# EAGLE schematic NN22_RPi_DetAdapter01_s00 (EAGLE 7.7.0)

## Sheet 1 of 6
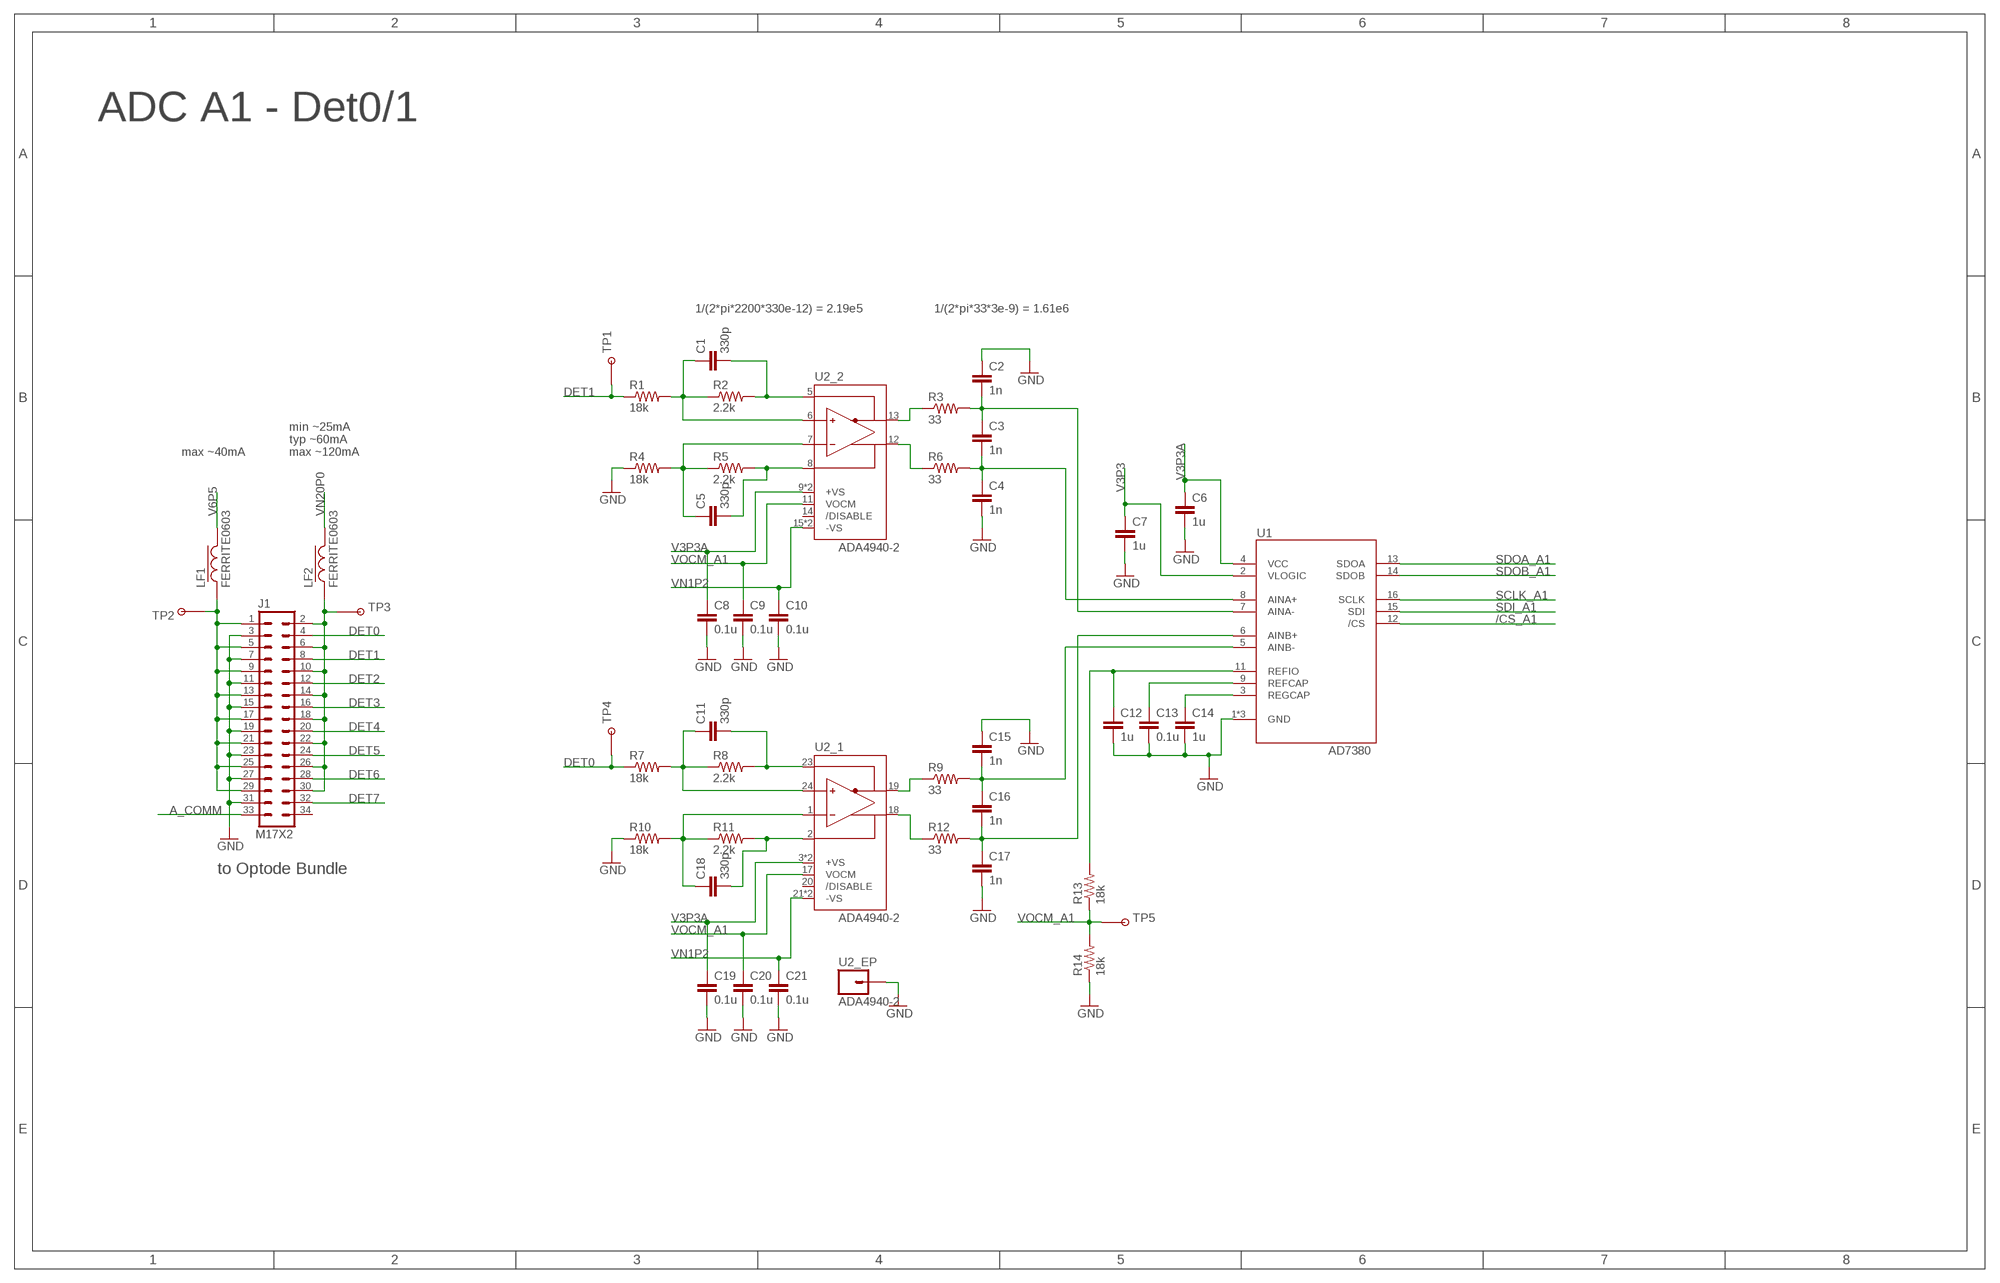
[diagram p0: schematic, sheet 1]

### Parts
C1  330p  CAP0402-CAP  [0402-CAP]
C2  1n  CAP0402-CAP  [0402-CAP]
C3  1n  CAP0402-CAP  [0402-CAP]
C4  1n  CAP0402-CAP  [0402-CAP]
C5  330p  CAP0402-CAP  [0402-CAP]
C6  1u  CAP0402-CAP  [0402-CAP]
C7  1u  CAP0402-CAP  [0402-CAP]
C8  0.1u  CAP0402-CAP  [0402-CAP]
C9  0.1u  CAP0402-CAP  [0402-CAP]
C10  0.1u  CAP0402-CAP  [0402-CAP]
C11  330p  CAP0402-CAP  [0402-CAP]
C12  1u  CAP0402-CAP  [0402-CAP]
C13  0.1u  CAP0402-CAP  [0402-CAP]
C14  1u  CAP0402-CAP  [0402-CAP]
C15  1n  CAP0402-CAP  [0402-CAP]
C16  1n  CAP0402-CAP  [0402-CAP]
C17  1n  CAP0402-CAP  [0402-CAP]
C18  330p  CAP0402-CAP  [0402-CAP]
C19  0.1u  CAP0402-CAP  [0402-CAP]
C20  0.1u  CAP0402-CAP  [0402-CAP]
C21  0.1u  CAP0402-CAP  [0402-CAP]
J1  M17X2  [M17X2_0.050_SHF]
LF1  FERRITE0603  [0603-FER]
LF2  FERRITE0603  [0603-FER]
R1  18k  RESISTOR0402-RES  [0402-RES]
R2  2.2k  RESISTOR0402-RES  [0402-RES]
R3  33  RESISTOR0402-RES  [0402-RES]
R4  18k  RESISTOR0402-RES  [0402-RES]
R5  2.2k  RESISTOR0402-RES  [0402-RES]
R6  33  RESISTOR0402-RES  [0402-RES]
R7  18k  RESISTOR0402-RES  [0402-RES]
R8  2.2k  RESISTOR0402-RES  [0402-RES]
R9  33  RESISTOR0402-RES  [0402-RES]
R10  18k  RESISTOR0402-RES  [0402-RES]
R11  2.2k  RESISTOR0402-RES  [0402-RES]
R12  33  RESISTOR0402-RES  [0402-RES]
R13  18k  RESISTOR0402-RES  [0402-RES]
R14  18k  RESISTOR0402-RES  [0402-RES]
TP1  TESTPOINT_ROUND  [TESTPAD_ROUND]
TP2  TESTPOINT_ROUND  [TESTPAD_ROUND]
TP3  TESTPOINT_ROUND  [TESTPAD_ROUND]
TP4  TESTPOINT_ROUND  [TESTPAD_ROUND]
TP5  TESTPOINT_ROUND  [TESTPAD_ROUND]
U1  AD7380  [LFCSP16]
U2  ADA4940-2  [LFCSP24]

### Nets
/CS_A1: U1.12(/CS) ; also sheet 5
A_COMM: J1.33 ; also sheet 5
DET0: J1.4 R7.1 TP4.P$1
DET1: J1.8 R1.1 TP1.P$1
DET2: J1.12 ; also sheet 3
DET3: J1.16 ; also sheet 3
DET4: J1.20 ; also sheet 2
DET5: J1.24 ; also sheet 2
DET6: J1.28 ; also sheet 4
DET7: J1.32 ; also sheet 4
GND: C2.1 C4.2 C6.2 C7.2 C8.2 C9.2 C10.2 C12.2 C13.2 C14.2 C15.1 C17.2 C19.2 C20.2 C21.2 J1.3 J1.7 J1.11 J1.15 J1.19 J1.23 J1.27 J1.31 R4.1 R10.1 R14.1 U1.1(GND) U1.10(GND) U1.EP(GND) U2.EP ; also sheet 2,3,4,5,6
N$1: R3.1 U2.13(_2:-OUT)
N$2: R6.1 U2.12(_2:+OUT)
N$3: C2.2 C3.1 R3.2 U1.7(AINA-)
N$4: C3.2 C4.1 R6.2 U1.8(AINA+)
N$5: C11.2 R8.2 U2.23(_1:-FB)
N$6: C12.1 R13.2 U1.11(REFIO)
N$7: C13.1 U1.9(REFCAP)
N$8: C14.1 U1.3(REGCAP)
N$9: C18.2 R11.2 U2.2(_1:+FB)
N$11: R9.1 U2.19(_1:-OUT)
N$12: R12.1 U2.18(_1:+OUT)
N$13: C15.2 C16.1 R9.2 U1.5(AINB-)
N$14: C16.2 C17.1 R12.2 U1.6(AINB+)
N$19: C1.1 R1.2 R2.1 U2.6(_2:+IN)
N$20: C1.2 R2.2 U2.5(_2:-FB)
N$21: C5.2 R5.2 U2.8(_2:+FB)
N$22: C5.1 R4.2 R5.1 U2.7(_2:-IN)
N$23: C11.1 R7.2 R8.1 U2.24(_1:+IN)
N$24: C18.1 R10.2 R11.1 U2.1(_1:-IN)
SCLK_A1: U1.16(SCLK) ; also sheet 5
SDI_A1: U1.15(SDI) ; also sheet 5
SDOA_A1: U1.13(SDOA) ; also sheet 5
SDOB_A1: U1.14(SDOB) ; also sheet 5
V3P3: C7.1 U1.2(VLOGIC) ; also sheet 2,3,4,5,6
V3P3A: C6.1 C8.1 C19.1 U1.4(VCC) U2.3(_1:+VS) U2.4(_1:+VS) U2.9(_2:+VS) U2.10(_2:+VS) ; also sheet 2,3,4,6
V6P5: LF1.2 ; also sheet 6
V6P5CON: J1.1 J1.5 J1.9 J1.13 J1.17 J1.21 J1.25 J1.29 LF1.1 TP2.P$1
VN1P2: C10.1 C21.1 U2.15(_2:-VS) U2.16(_2:-VS) U2.21(_1:-VS) U2.22(_1:-VS) ; also sheet 2,3,4,6
VN20P0: LF2.2 ; also sheet 6
VN20P0CON: J1.2 J1.6 J1.10 J1.14 J1.18 J1.22 J1.26 J1.30 LF2.1 TP3.P$1
VOCM_A1: C9.1 C20.1 R13.1 R14.2 TP5.P$1 U2.11(_2:VOCM) U2.17(_1:VOCM)
Unconnected: J1.34 U2.14(_2:/DISABLE) U2.20(_1:/DISABLE)

### Notes on the sheet
- ADC A1 - Det0/1
- 1/(2*pi*2200*330e-12) = 2.19e5 | 1/(2*pi*33*3e-9) = 1.61e6
- max ~40mA
- min ~25mA
  typ ~60mA
  max ~120mA
- to Optode Bundle

## Sheet 2 of 6
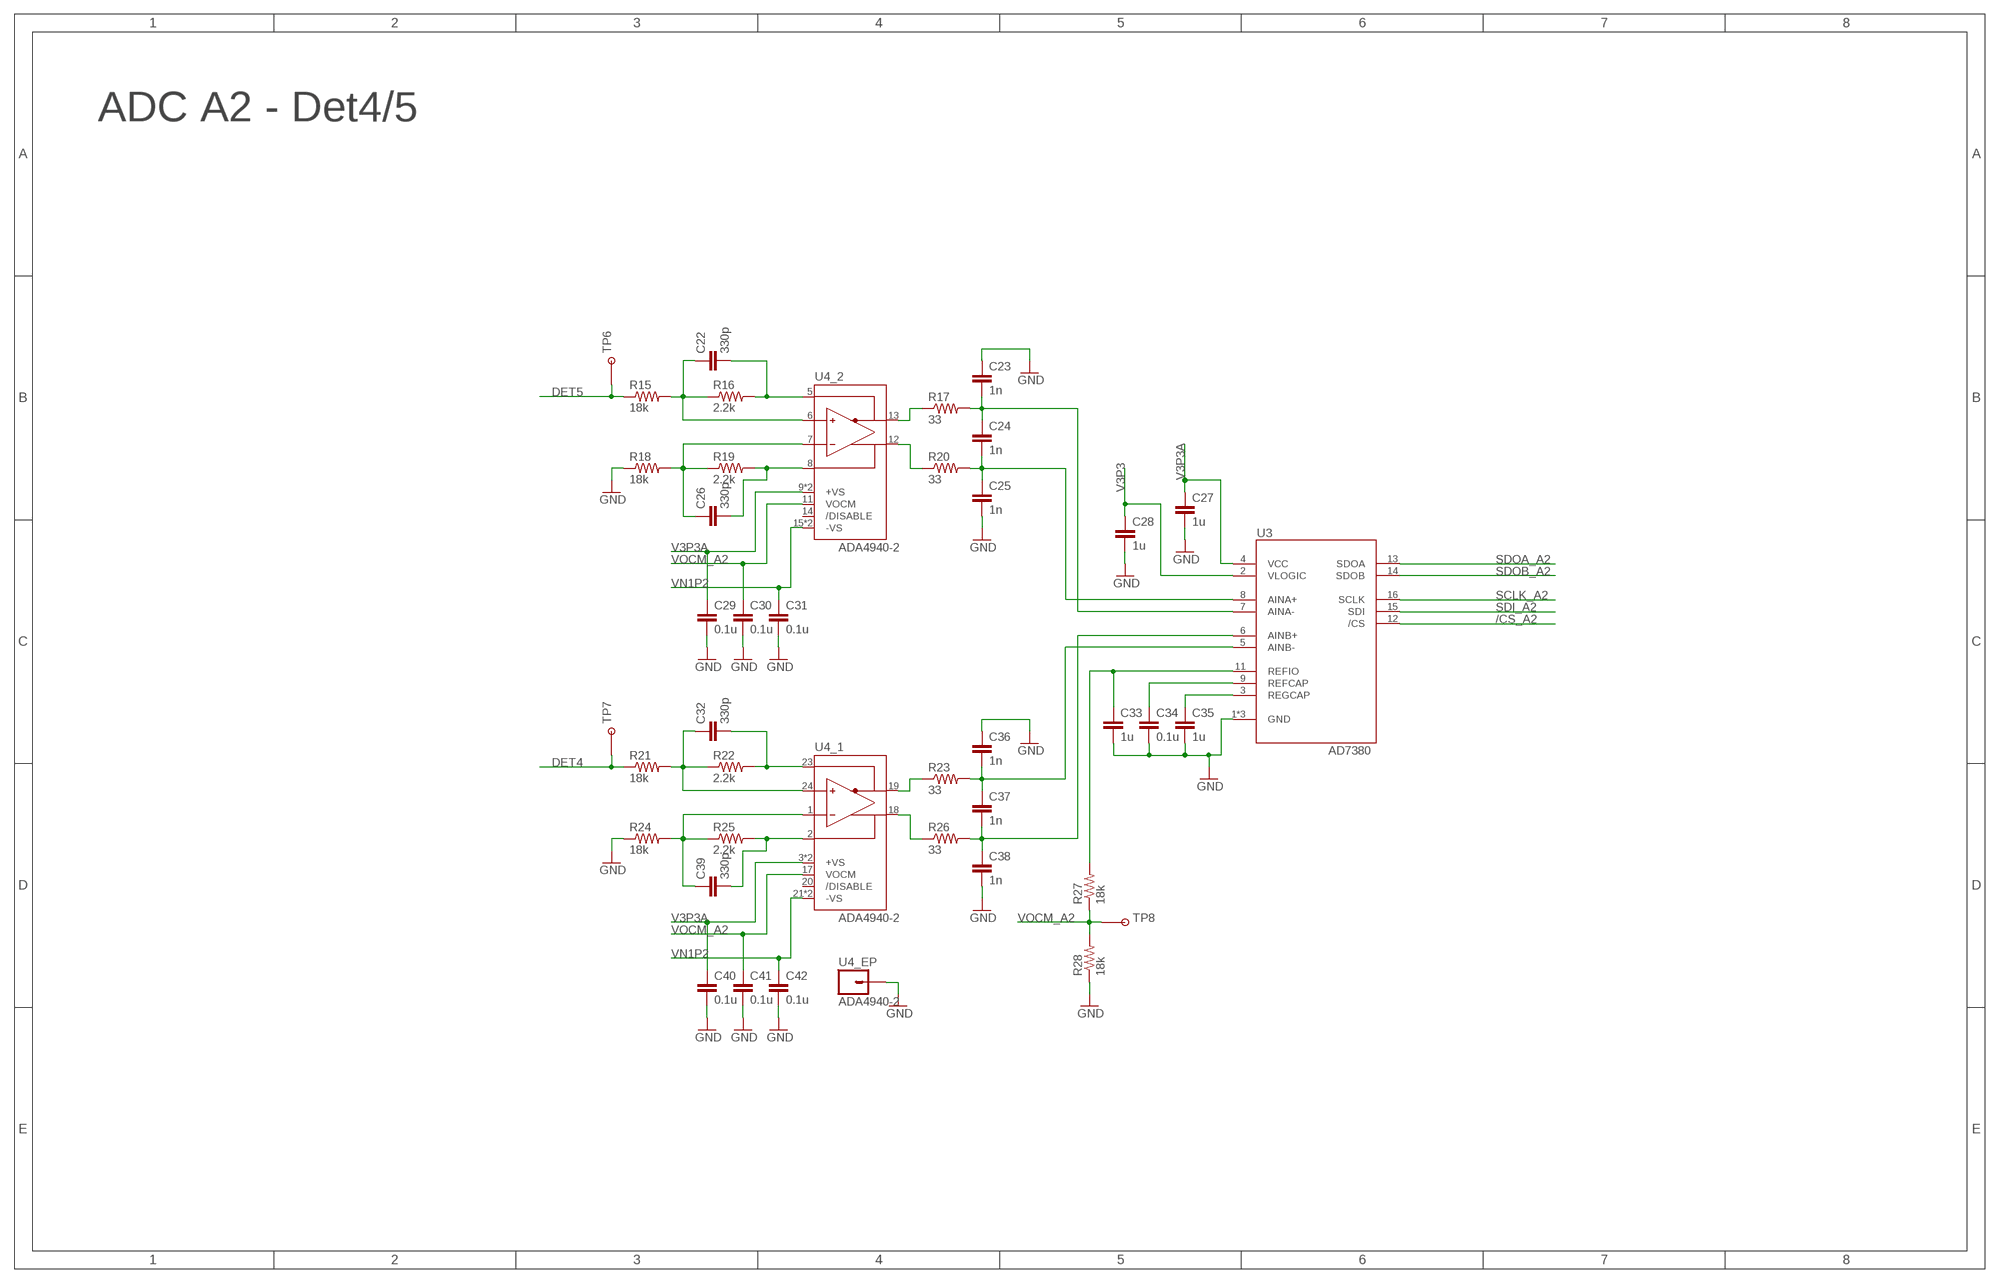
[diagram p1: schematic, sheet 2]

### Parts
C22  330p  CAP0402-CAP  [0402-CAP]
C23  1n  CAP0402-CAP  [0402-CAP]
C24  1n  CAP0402-CAP  [0402-CAP]
C25  1n  CAP0402-CAP  [0402-CAP]
C26  330p  CAP0402-CAP  [0402-CAP]
C27  1u  CAP0402-CAP  [0402-CAP]
C28  1u  CAP0402-CAP  [0402-CAP]
C29  0.1u  CAP0402-CAP  [0402-CAP]
C30  0.1u  CAP0402-CAP  [0402-CAP]
C31  0.1u  CAP0402-CAP  [0402-CAP]
C32  330p  CAP0402-CAP  [0402-CAP]
C33  1u  CAP0402-CAP  [0402-CAP]
C34  0.1u  CAP0402-CAP  [0402-CAP]
C35  1u  CAP0402-CAP  [0402-CAP]
C36  1n  CAP0402-CAP  [0402-CAP]
C37  1n  CAP0402-CAP  [0402-CAP]
C38  1n  CAP0402-CAP  [0402-CAP]
C39  330p  CAP0402-CAP  [0402-CAP]
C40  0.1u  CAP0402-CAP  [0402-CAP]
C41  0.1u  CAP0402-CAP  [0402-CAP]
C42  0.1u  CAP0402-CAP  [0402-CAP]
R15  18k  RESISTOR0402-RES  [0402-RES]
R16  2.2k  RESISTOR0402-RES  [0402-RES]
R17  33  RESISTOR0402-RES  [0402-RES]
R18  18k  RESISTOR0402-RES  [0402-RES]
R19  2.2k  RESISTOR0402-RES  [0402-RES]
R20  33  RESISTOR0402-RES  [0402-RES]
R21  18k  RESISTOR0402-RES  [0402-RES]
R22  2.2k  RESISTOR0402-RES  [0402-RES]
R23  33  RESISTOR0402-RES  [0402-RES]
R24  18k  RESISTOR0402-RES  [0402-RES]
R25  2.2k  RESISTOR0402-RES  [0402-RES]
R26  33  RESISTOR0402-RES  [0402-RES]
R27  18k  RESISTOR0402-RES  [0402-RES]
R28  18k  RESISTOR0402-RES  [0402-RES]
TP6  TESTPOINT_ROUND  [TESTPAD_ROUND]
TP7  TESTPOINT_ROUND  [TESTPAD_ROUND]
TP8  TESTPOINT_ROUND  [TESTPAD_ROUND]
U3  AD7380  [LFCSP16]
U4  ADA4940-2  [LFCSP24]

### Nets
/CS_A2: U3.12(/CS) ; also sheet 5
DET4: R21.1 TP7.P$1 ; also sheet 1
DET5: R15.1 TP6.P$1 ; also sheet 1
GND: C23.1 C25.2 C27.2 C28.2 C29.2 C30.2 C31.2 C33.2 C34.2 C35.2 C36.1 C38.2 C40.2 C41.2 C42.2 R18.1 R24.1 R28.1 U3.1(GND) U3.10(GND) U3.EP(GND) U4.EP ; also sheet 1,3,4,5,6
N$10: R17.1 U4.13(_2:-OUT)
N$15: R20.1 U4.12(_2:+OUT)
N$25: C23.2 C24.1 R17.2 U3.7(AINA-)
N$26: C24.2 C25.1 R20.2 U3.8(AINA+)
N$32: C33.1 R27.2 U3.11(REFIO)
N$33: C34.1 U3.9(REFCAP)
N$34: C35.1 U3.3(REGCAP)
N$39: R23.1 U4.19(_1:-OUT)
N$40: R26.1 U4.18(_1:+OUT)
N$41: C36.2 C37.1 R23.2 U3.5(AINB-)
N$42: C37.2 C38.1 R26.2 U3.6(AINB+)
N$45: C22.1 R15.2 R16.1 U4.6(_2:+IN)
N$46: C22.2 R16.2 U4.5(_2:-FB)
N$47: C26.2 R19.2 U4.8(_2:+FB)
N$48: C26.1 R18.2 R19.1 U4.7(_2:-IN)
N$49: C32.1 R21.2 R22.1 U4.24(_1:+IN)
N$50: C39.1 R24.2 R25.1 U4.1(_1:-IN)
N$51: C32.2 R22.2 U4.23(_1:-FB)
N$52: C39.2 R25.2 U4.2(_1:+FB)
SCLK_A2: U3.16(SCLK) ; also sheet 5
SDI_A2: U3.15(SDI) ; also sheet 5
SDOA_A2: U3.13(SDOA) ; also sheet 5
SDOB_A2: U3.14(SDOB) ; also sheet 5
V3P3: C28.1 U3.2(VLOGIC) ; also sheet 1,3,4,5,6
V3P3A: C27.1 C29.1 C40.1 U3.4(VCC) U4.3(_1:+VS) U4.4(_1:+VS) U4.9(_2:+VS) U4.10(_2:+VS) ; also sheet 1,3,4,6
VN1P2: C31.1 C42.1 U4.15(_2:-VS) U4.16(_2:-VS) U4.21(_1:-VS) U4.22(_1:-VS) ; also sheet 1,3,4,6
VOCM_A2: C30.1 C41.1 R27.1 R28.2 TP8.P$1 U4.11(_2:VOCM) U4.17(_1:VOCM)
Unconnected: U4.14(_2:/DISABLE) U4.20(_1:/DISABLE)

### Notes on the sheet
- ADC A2 - Det4/5

## Sheet 3 of 6
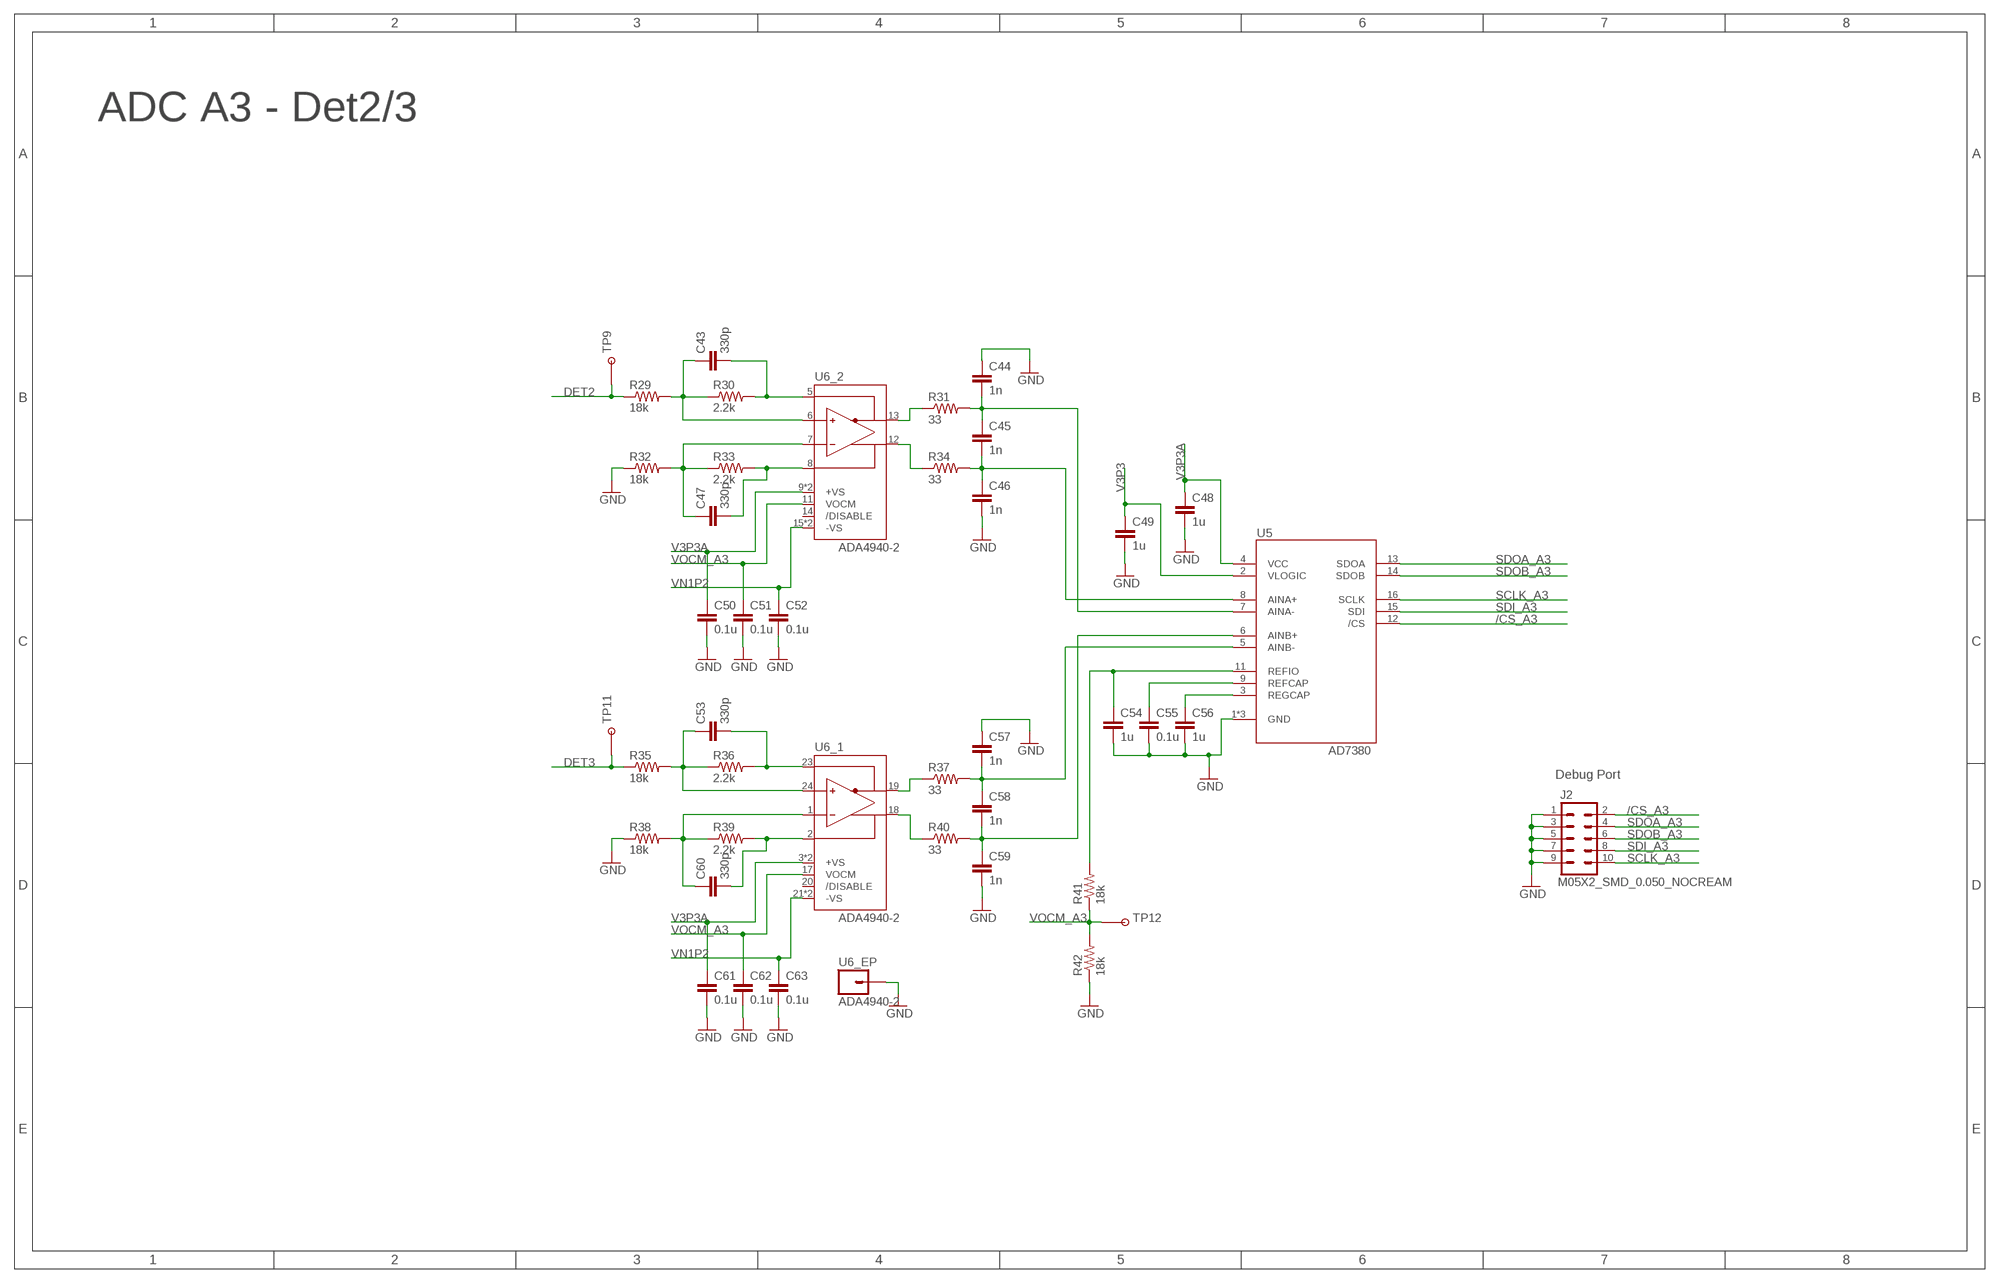
[diagram p2: schematic, sheet 3]

### Parts
C43  330p  CAP0402-CAP  [0402-CAP]
C44  1n  CAP0402-CAP  [0402-CAP]
C45  1n  CAP0402-CAP  [0402-CAP]
C46  1n  CAP0402-CAP  [0402-CAP]
C47  330p  CAP0402-CAP  [0402-CAP]
C48  1u  CAP0402-CAP  [0402-CAP]
C49  1u  CAP0402-CAP  [0402-CAP]
C50  0.1u  CAP0402-CAP  [0402-CAP]
C51  0.1u  CAP0402-CAP  [0402-CAP]
C52  0.1u  CAP0402-CAP  [0402-CAP]
C53  330p  CAP0402-CAP  [0402-CAP]
C54  1u  CAP0402-CAP  [0402-CAP]
C55  0.1u  CAP0402-CAP  [0402-CAP]
C56  1u  CAP0402-CAP  [0402-CAP]
C57  1n  CAP0402-CAP  [0402-CAP]
C58  1n  CAP0402-CAP  [0402-CAP]
C59  1n  CAP0402-CAP  [0402-CAP]
C60  330p  CAP0402-CAP  [0402-CAP]
C61  0.1u  CAP0402-CAP  [0402-CAP]
C62  0.1u  CAP0402-CAP  [0402-CAP]
C63  0.1u  CAP0402-CAP  [0402-CAP]
J2  M05X2_SMD_0.050_NOCREAM  [M05X2_0.050_SMD_NO_CREAM]
R29  18k  RESISTOR0402-RES  [0402-RES]
R30  2.2k  RESISTOR0402-RES  [0402-RES]
R31  33  RESISTOR0402-RES  [0402-RES]
R32  18k  RESISTOR0402-RES  [0402-RES]
R33  2.2k  RESISTOR0402-RES  [0402-RES]
R34  33  RESISTOR0402-RES  [0402-RES]
R35  18k  RESISTOR0402-RES  [0402-RES]
R36  2.2k  RESISTOR0402-RES  [0402-RES]
R37  33  RESISTOR0402-RES  [0402-RES]
R38  18k  RESISTOR0402-RES  [0402-RES]
R39  2.2k  RESISTOR0402-RES  [0402-RES]
R40  33  RESISTOR0402-RES  [0402-RES]
R41  18k  RESISTOR0402-RES  [0402-RES]
R42  18k  RESISTOR0402-RES  [0402-RES]
TP9  TESTPOINT_ROUND  [TESTPAD_ROUND]
TP11  TESTPOINT_ROUND  [TESTPAD_ROUND]
TP12  TESTPOINT_ROUND  [TESTPAD_ROUND]
U5  AD7380  [LFCSP16]
U6  ADA4940-2  [LFCSP24]

### Nets
/CS_A3: J2.2 U5.12(/CS) ; also sheet 5
DET2: R29.1 TP9.P$1 ; also sheet 1
DET3: R35.1 TP11.P$1 ; also sheet 1
GND: C44.1 C46.2 C48.2 C49.2 C50.2 C51.2 C52.2 C54.2 C55.2 C56.2 C57.1 C59.2 C61.2 C62.2 C63.2 J2.1 J2.3 J2.5 J2.7 J2.9 R32.1 R38.1 R42.1 U5.1(GND) U5.10(GND) U5.EP(GND) U6.EP ; also sheet 1,2,4,5,6
N$55: R31.1 U6.13(_2:-OUT)
N$56: R34.1 U6.12(_2:+OUT)
N$57: C44.2 C45.1 R31.2 U5.7(AINA-)
N$58: C45.2 C46.1 R34.2 U5.8(AINA+)
N$59: C54.1 R41.2 U5.11(REFIO)
N$60: C55.1 U5.9(REFCAP)
N$61: C56.1 U5.3(REGCAP)
N$62: R37.1 U6.19(_1:-OUT)
N$63: R40.1 U6.18(_1:+OUT)
N$64: C57.2 C58.1 R37.2 U5.5(AINB-)
N$65: C58.2 C59.1 R40.2 U5.6(AINB+)
N$68: C43.1 R29.2 R30.1 U6.6(_2:+IN)
N$69: C43.2 R30.2 U6.5(_2:-FB)
N$70: C47.2 R33.2 U6.8(_2:+FB)
N$71: C47.1 R32.2 R33.1 U6.7(_2:-IN)
N$72: C53.1 R35.2 R36.1 U6.24(_1:+IN)
N$73: C60.1 R38.2 R39.1 U6.1(_1:-IN)
N$74: C53.2 R36.2 U6.23(_1:-FB)
N$75: C60.2 R39.2 U6.2(_1:+FB)
SCLK_A3: J2.10 U5.16(SCLK) ; also sheet 5
SDI_A3: J2.8 U5.15(SDI) ; also sheet 5
SDOA_A3: J2.4 U5.13(SDOA) ; also sheet 5
SDOB_A3: J2.6 U5.14(SDOB) ; also sheet 5
V3P3: C49.1 U5.2(VLOGIC) ; also sheet 1,2,4,5,6
V3P3A: C48.1 C50.1 C61.1 U5.4(VCC) U6.3(_1:+VS) U6.4(_1:+VS) U6.9(_2:+VS) U6.10(_2:+VS) ; also sheet 1,2,4,6
VN1P2: C52.1 C63.1 U6.15(_2:-VS) U6.16(_2:-VS) U6.21(_1:-VS) U6.22(_1:-VS) ; also sheet 1,2,4,6
VOCM_A3: C51.1 C62.1 R41.1 R42.2 TP12.P$1 U6.11(_2:VOCM) U6.17(_1:VOCM)
Unconnected: U6.14(_2:/DISABLE) U6.20(_1:/DISABLE)

### Notes on the sheet
- ADC A3 - Det2/3
- Debug Port

## Sheet 4 of 6
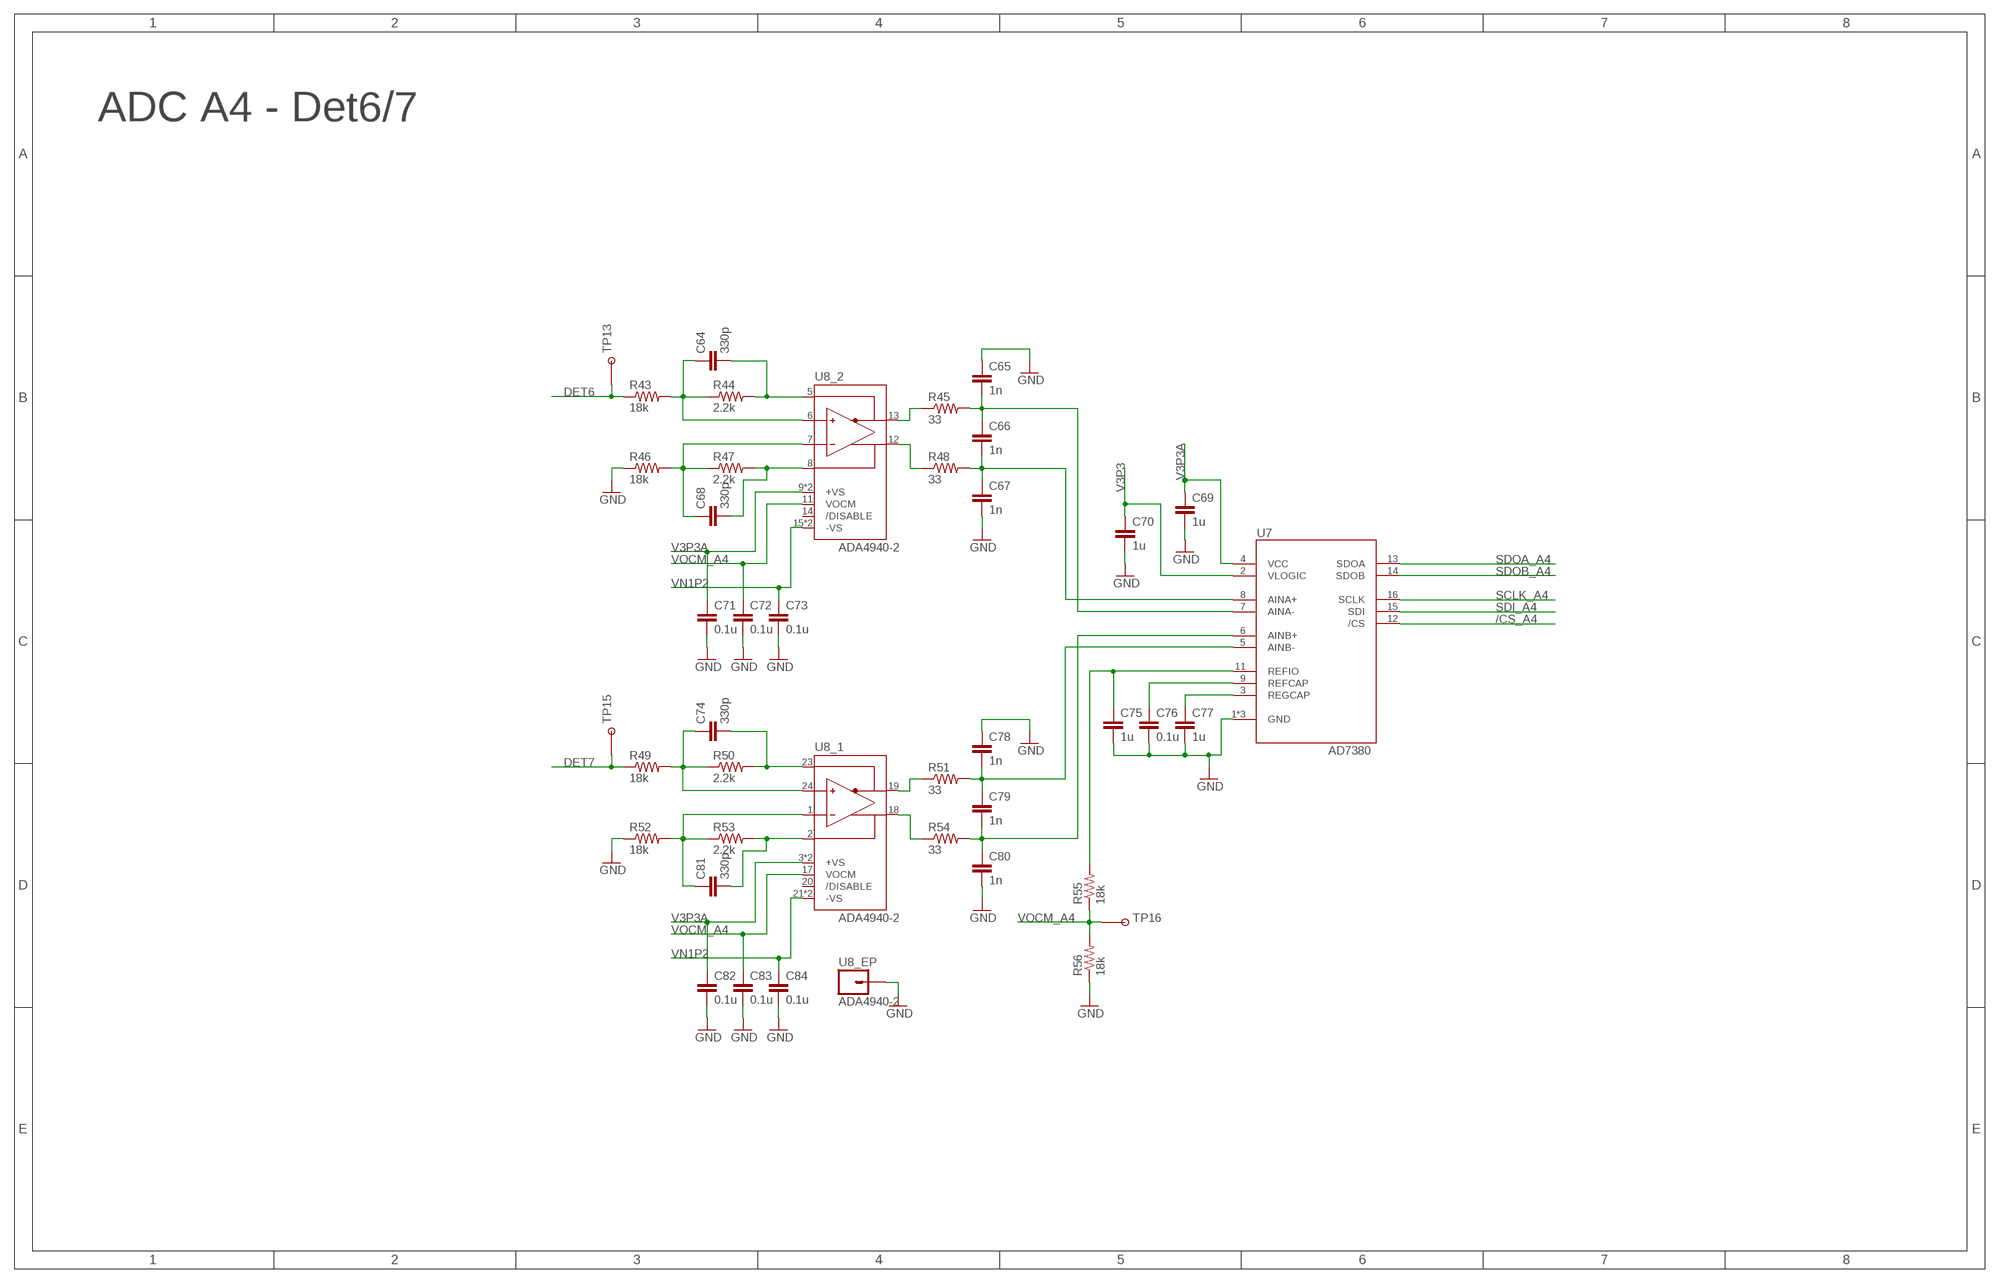
[diagram p3: schematic, sheet 4]

### Parts
C64  330p  CAP0402-CAP  [0402-CAP]
C65  1n  CAP0402-CAP  [0402-CAP]
C66  1n  CAP0402-CAP  [0402-CAP]
C67  1n  CAP0402-CAP  [0402-CAP]
C68  330p  CAP0402-CAP  [0402-CAP]
C69  1u  CAP0402-CAP  [0402-CAP]
C70  1u  CAP0402-CAP  [0402-CAP]
C71  0.1u  CAP0402-CAP  [0402-CAP]
C72  0.1u  CAP0402-CAP  [0402-CAP]
C73  0.1u  CAP0402-CAP  [0402-CAP]
C74  330p  CAP0402-CAP  [0402-CAP]
C75  1u  CAP0402-CAP  [0402-CAP]
C76  0.1u  CAP0402-CAP  [0402-CAP]
C77  1u  CAP0402-CAP  [0402-CAP]
C78  1n  CAP0402-CAP  [0402-CAP]
C79  1n  CAP0402-CAP  [0402-CAP]
C80  1n  CAP0402-CAP  [0402-CAP]
C81  330p  CAP0402-CAP  [0402-CAP]
C82  0.1u  CAP0402-CAP  [0402-CAP]
C83  0.1u  CAP0402-CAP  [0402-CAP]
C84  0.1u  CAP0402-CAP  [0402-CAP]
R43  18k  RESISTOR0402-RES  [0402-RES]
R44  2.2k  RESISTOR0402-RES  [0402-RES]
R45  33  RESISTOR0402-RES  [0402-RES]
R46  18k  RESISTOR0402-RES  [0402-RES]
R47  2.2k  RESISTOR0402-RES  [0402-RES]
R48  33  RESISTOR0402-RES  [0402-RES]
R49  18k  RESISTOR0402-RES  [0402-RES]
R50  2.2k  RESISTOR0402-RES  [0402-RES]
R51  33  RESISTOR0402-RES  [0402-RES]
R52  18k  RESISTOR0402-RES  [0402-RES]
R53  2.2k  RESISTOR0402-RES  [0402-RES]
R54  33  RESISTOR0402-RES  [0402-RES]
R55  18k  RESISTOR0402-RES  [0402-RES]
R56  18k  RESISTOR0402-RES  [0402-RES]
TP13  TESTPOINT_ROUND  [TESTPAD_ROUND]
TP15  TESTPOINT_ROUND  [TESTPAD_ROUND]
TP16  TESTPOINT_ROUND  [TESTPAD_ROUND]
U7  AD7380  [LFCSP16]
U8  ADA4940-2  [LFCSP24]

### Nets
/CS_A4: U7.12(/CS) ; also sheet 5
DET6: R43.1 TP13.P$1 ; also sheet 1
DET7: R49.1 TP15.P$1 ; also sheet 1
GND: C65.1 C67.2 C69.2 C70.2 C71.2 C72.2 C73.2 C75.2 C76.2 C77.2 C78.1 C80.2 C82.2 C83.2 C84.2 R46.1 R52.1 R56.1 U7.1(GND) U7.10(GND) U7.EP(GND) U8.EP ; also sheet 1,2,3,5,6
N$78: R45.1 U8.13(_2:-OUT)
N$79: R48.1 U8.12(_2:+OUT)
N$80: C65.2 C66.1 R45.2 U7.7(AINA-)
N$81: C66.2 C67.1 R48.2 U7.8(AINA+)
N$82: C75.1 R55.2 U7.11(REFIO)
N$83: C76.1 U7.9(REFCAP)
N$84: C77.1 U7.3(REGCAP)
N$85: R51.1 U8.19(_1:-OUT)
N$86: R54.1 U8.18(_1:+OUT)
N$87: C78.2 C79.1 R51.2 U7.5(AINB-)
N$88: C79.2 C80.1 R54.2 U7.6(AINB+)
N$91: C64.1 R43.2 R44.1 U8.6(_2:+IN)
N$92: C64.2 R44.2 U8.5(_2:-FB)
N$93: C68.2 R47.2 U8.8(_2:+FB)
N$94: C68.1 R46.2 R47.1 U8.7(_2:-IN)
N$95: C74.1 R49.2 R50.1 U8.24(_1:+IN)
N$96: C81.1 R52.2 R53.1 U8.1(_1:-IN)
N$97: C74.2 R50.2 U8.23(_1:-FB)
N$98: C81.2 R53.2 U8.2(_1:+FB)
SCLK_A4: U7.16(SCLK) ; also sheet 5
SDI_A4: U7.15(SDI) ; also sheet 5
SDOA_A4: U7.13(SDOA) ; also sheet 5
SDOB_A4: U7.14(SDOB) ; also sheet 5
V3P3: C70.1 U7.2(VLOGIC) ; also sheet 1,2,3,5,6
V3P3A: C69.1 C71.1 C82.1 U7.4(VCC) U8.3(_1:+VS) U8.4(_1:+VS) U8.9(_2:+VS) U8.10(_2:+VS) ; also sheet 1,2,3,6
VN1P2: C73.1 C84.1 U8.15(_2:-VS) U8.16(_2:-VS) U8.21(_1:-VS) U8.22(_1:-VS) ; also sheet 1,2,3,6
VOCM_A4: C72.1 C83.1 R55.1 R56.2 TP16.P$1 U8.11(_2:VOCM) U8.17(_1:VOCM)
Unconnected: U8.14(_2:/DISABLE) U8.20(_1:/DISABLE)

### Notes on the sheet
- ADC A4 - Det6/7

## Sheet 5 of 6
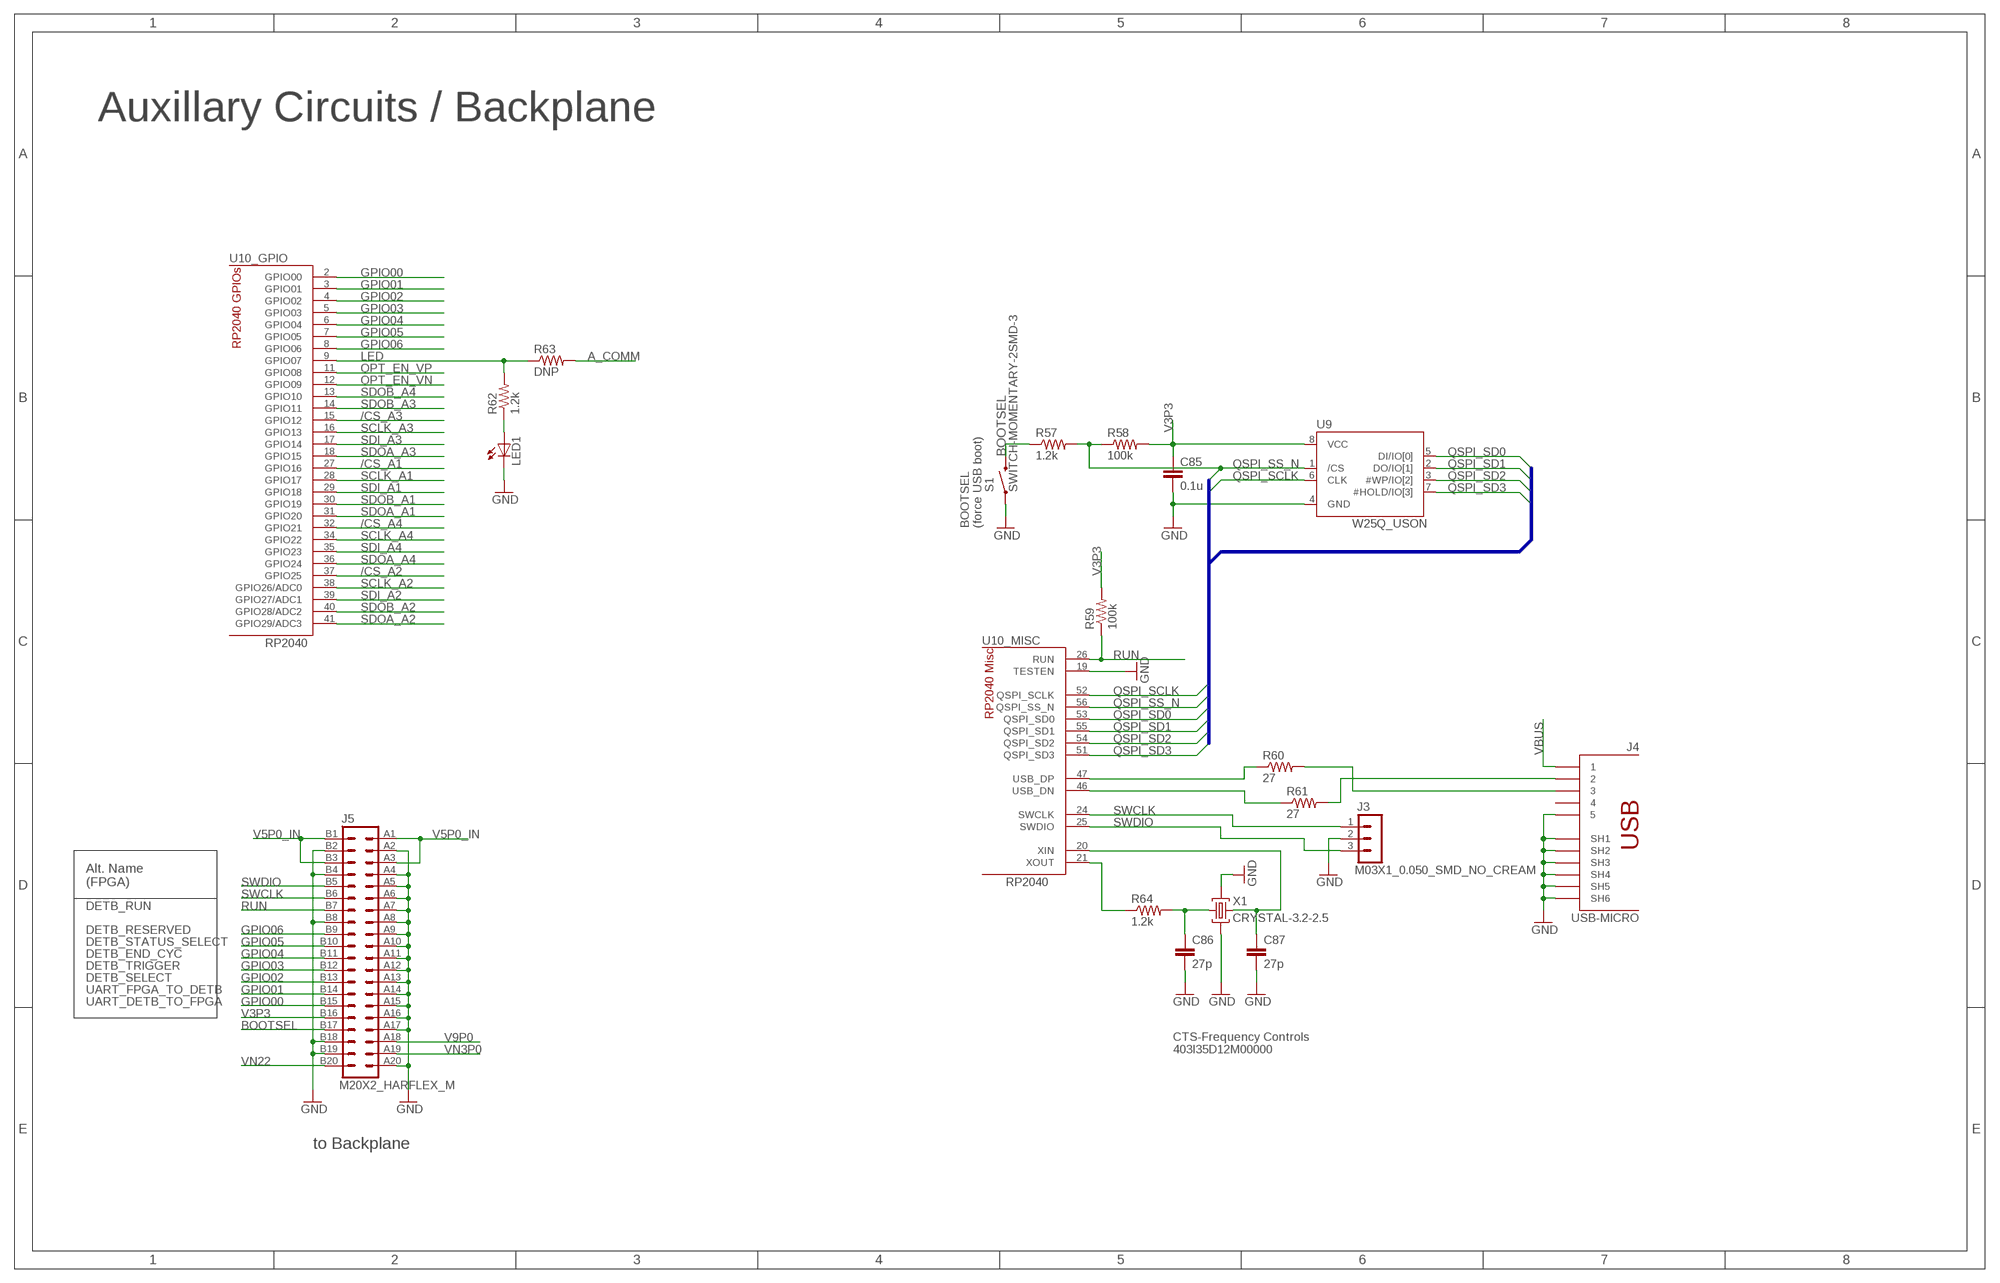
[diagram p4: schematic, sheet 5]

### Parts
C85  0.1u  CAP0402-CAP  [0402-CAP]
C86  27p  CAP0402-CAP  [0402-CAP]
C87  27p  CAP0402-CAP  [0402-CAP]
J3  M03X1_0.050_SMD_NO_CREAM  [M03X1_0.050_SMD_NO_CREAM]
J4  USB-MICRO  [USB-MICRO]
J5  M20X2_HARFLEX_M  [M20X2_HARFLEX_M]
LED1  LED0603  [LED-0603]
R57  1.2k  RESISTOR0402-RES  [0402-RES]
R58  100k  RESISTOR0402-RES  [0402-RES]
R59  100k  RESISTOR0402-RES  [0402-RES]
R60  27  RESISTOR0402-RES  [0402-RES]
R61  27  RESISTOR0402-RES  [0402-RES]
R62  1.2k  RESISTOR0402-RES  [0402-RES]
R63  DNP  RESISTOR0402-RES  [0402-RES]
R64  1.2k  RESISTOR0402-RES  [0402-RES]
S1  SWITCH-MOMENTARY-2SMD-3  [TACTILE_SWITCH_SMD-3]
U9  W25Q_USON  [USON8L-2X3MM]
U10  RP2040  [QFN-56_EP]
X1  CRYSTAL-3.2-2.5  [CRYSTAL-3.2-2.5]

### Nets
/CS_A1: U10.27(_GPIO:GPIO16) ; also sheet 1
/CS_A2: U10.37(_GPIO:GPIO25) ; also sheet 2
/CS_A3: U10.15(_GPIO:GPIO12) ; also sheet 3
/CS_A4: U10.32(_GPIO:GPIO21) ; also sheet 4
A_COMM: R63.2 ; also sheet 1
BOOTSEL: J5.B17 R57.1 S1.4
GND: C85.2 C86.2 C87.2 J3.2 J4.5 J4.SH1 J4.SH2 J4.SH3 J4.SH4 J4.SH5 J4.SH6 J5.A2 J5.A4 J5.A5 J5.A6 J5.A7 J5.A8 J5.A9 J5.A10 J5.A11 J5.A12 J5.A13 J5.A14 J5.A15 J5.A16 J5.A17 J5.A20 J5.B2 J5.B4 J5.B8 J5.B18 J5.B19 LED1.C S1.1 U9.4(GND) U10.19(_MISC:TESTEN) X1.2(GND) X1.4(GND) ; also sheet 1,2,3,4,6
GPIO00: J5.B15 U10.2(_GPIO:GPIO00)
GPIO01: J5.B14 U10.3(_GPIO:GPIO01)
GPIO02: J5.B13 U10.4(_GPIO:GPIO02)
GPIO03: J5.B12 U10.5(_GPIO:GPIO03)
GPIO04: J5.B11 U10.6(_GPIO:GPIO04)
GPIO05: J5.B10 U10.7(_GPIO:GPIO05)
GPIO06: J5.B9 U10.8(_GPIO:GPIO06)
LED: R62.2 R63.1 U10.9(_GPIO:GPIO07)
N$16: C87.1 U10.20(_MISC:XIN) X1.3(C2)
N$17: C86.1 R64.2 X1.1(C1)
N$18: R64.1 U10.21(_MISC:XOUT)
N$29: R60.1 U10.47(_MISC:USB_DP)
N$30: R61.1 U10.46(_MISC:USB_DN)
N$35: J4.2 R61.2
N$37: J4.3 R60.2
N$109: LED1.A R62.1
OPT_EN_VN: U10.12(_GPIO:GPIO09) ; also sheet 6
OPT_EN_VP: U10.11(_GPIO:GPIO08) ; also sheet 6
QSPI_SCLK: U9.6(CLK) U10.52(_MISC:QSPI_SCLK)
QSPI_SD0: U9.5(DI/IO[0]) U10.53(_MISC:QSPI_SD0)
QSPI_SD1: U9.2(DO/IO[1]) U10.55(_MISC:QSPI_SD1)
QSPI_SD2: U9.3(#WP/IO[2]) U10.54(_MISC:QSPI_SD2)
QSPI_SD3: U9.7(#HOLD/IO[3]) U10.51(_MISC:QSPI_SD3)
QSPI_SS_N: R57.2 R58.1 U9.1(/CS) U10.56(_MISC:QSPI_SS_N)
RUN: J5.B7 R59.1 U10.26(_MISC:RUN)
SCLK_A1: U10.28(_GPIO:GPIO17) ; also sheet 1
SCLK_A2: U10.38(_GPIO:GPIO26/ADC0) ; also sheet 2
SCLK_A3: U10.16(_GPIO:GPIO13) ; also sheet 3
SCLK_A4: U10.34(_GPIO:GPIO22) ; also sheet 4
SDI_A1: U10.29(_GPIO:GPIO18) ; also sheet 1
SDI_A2: U10.39(_GPIO:GPIO27/ADC1) ; also sheet 2
SDI_A3: U10.17(_GPIO:GPIO14) ; also sheet 3
SDI_A4: U10.35(_GPIO:GPIO23) ; also sheet 4
SDOA_A1: U10.31(_GPIO:GPIO20) ; also sheet 1
SDOA_A2: U10.41(_GPIO:GPIO29/ADC3) ; also sheet 2
SDOA_A3: U10.18(_GPIO:GPIO15) ; also sheet 3
SDOA_A4: U10.36(_GPIO:GPIO24) ; also sheet 4
SDOB_A1: U10.30(_GPIO:GPIO19) ; also sheet 1
SDOB_A2: U10.40(_GPIO:GPIO28/ADC2) ; also sheet 2
SDOB_A3: U10.14(_GPIO:GPIO11) ; also sheet 3
SDOB_A4: U10.13(_GPIO:GPIO10) ; also sheet 4
SWCLK: J3.1 J5.B6 U10.24(_MISC:SWCLK)
SWDIO: J3.3 J5.B5 U10.25(_MISC:SWDIO)
V3P3: C85.1 J5.B16 R58.2 R59.2 U9.8(VCC) ; also sheet 1,2,3,4,6
V5P0_IN: J5.A1 J5.A3 J5.B1 J5.B3 ; also sheet 6
V9P0: J5.A18 ; also sheet 6
VBUS: J4.1 ; also sheet 6
VN3P0: J5.A19 ; also sheet 6
VN22: J5.B20 ; also sheet 6
Unconnected: J4.4

### Buses
QSPI_SCLK,QSPI_SS_N,QSPI_SD[0..3]

### Notes on the sheet
- Auxillary Circuits / Backplane
- BOOTSEL
  (force USB boot)
- Alt. Name
  (FPGA)
- DETB_RUN
- DETB_RESERVED
- DETB_STATUS_SELECT
- DETB_END_CYC
- DETB_TRIGGER
- DETB_SELECT
- UART_FPGA_TO_DETB
- UART_DETB_TO_FPGA
- CTS-Frequency Controls
  403I35D12M00000
- to Backplane

## Sheet 6 of 6
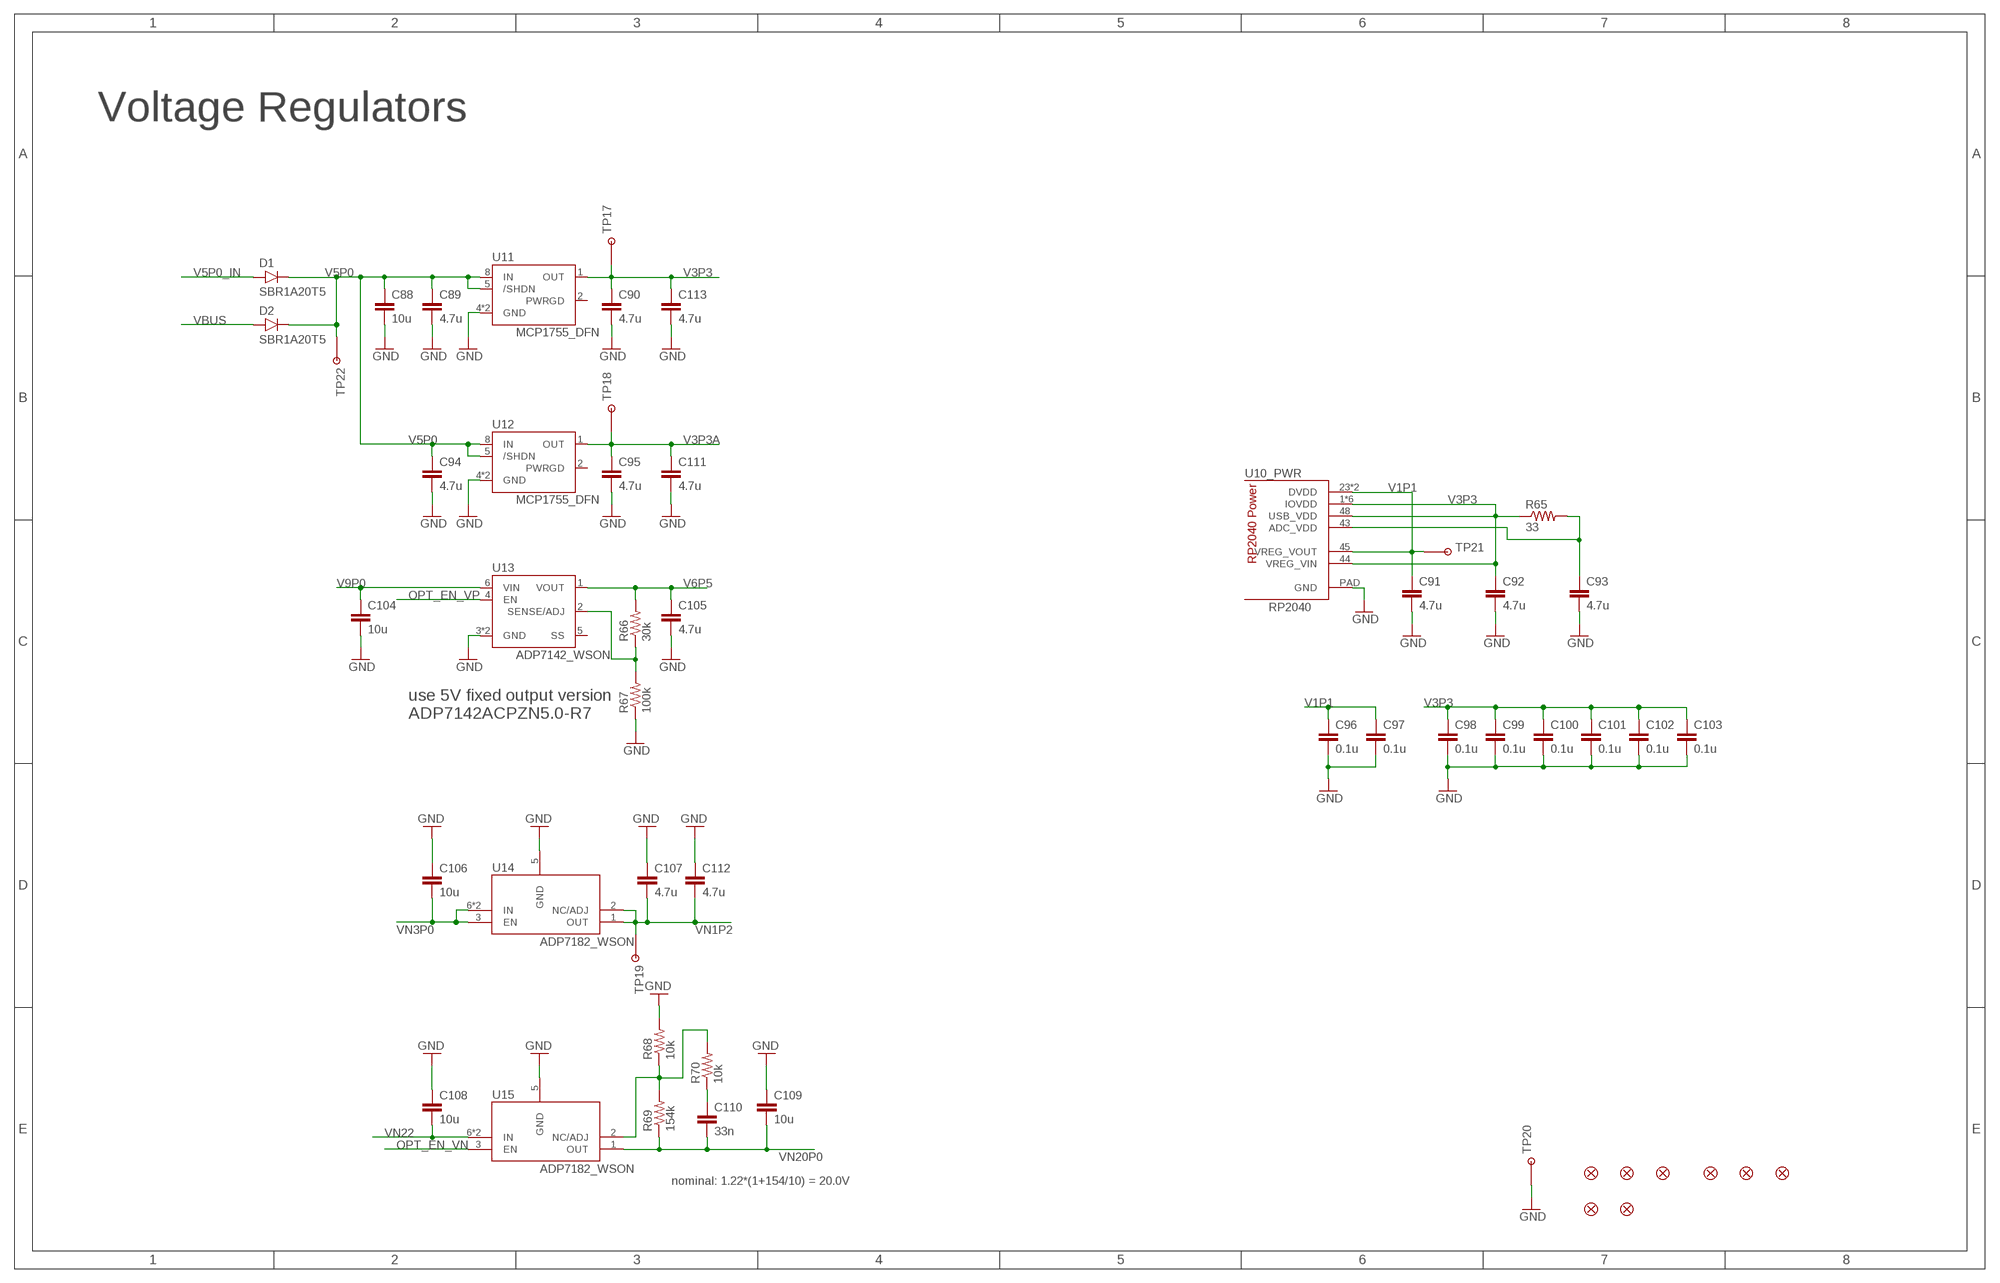
[diagram p5: schematic, sheet 6]

### Parts
C88  10u  CAP0603-CAP  [0603-CAP]
C89  4.7u  CAP0402-CAP  [0402-CAP]
C90  4.7u  CAP0402-CAP  [0402-CAP]
C91  4.7u  CAP0402-CAP  [0402-CAP]
C92  4.7u  CAP0402-CAP  [0402-CAP]
C93  4.7u  CAP0402-CAP  [0402-CAP]
C94  4.7u  CAP0402-CAP  [0402-CAP]
C95  4.7u  CAP0402-CAP  [0402-CAP]
C96  0.1u  CAP0402-CAP  [0402-CAP]
C97  0.1u  CAP0402-CAP  [0402-CAP]
C98  0.1u  CAP0402-CAP  [0402-CAP]
C99  0.1u  CAP0402-CAP  [0402-CAP]
C100  0.1u  CAP0402-CAP  [0402-CAP]
C101  0.1u  CAP0402-CAP  [0402-CAP]
C102  0.1u  CAP0402-CAP  [0402-CAP]
C103  0.1u  CAP0402-CAP  [0402-CAP]
C104  10u  CAP0603-CAP  [0603-CAP]
C105  4.7u  CAP0402-CAP  [0402-CAP]
C106  10u  CAP0603-CAP  [0603-CAP]
C107  4.7u  CAP0402-CAP  [0402-CAP]
C108  10u  CAP0603-CAP  [0603-CAP]
C109  10u  CAP0603-CAP  [0603-CAP]
C110  33n  CAP0402-CAP  [0402-CAP]
C111  4.7u  CAP0402-CAP  [0402-CAP]
C112  4.7u  CAP0402-CAP  [0402-CAP]
C113  4.7u  CAP0402-CAP  [0402-CAP]
D1  SBR1A20T5  DIODE_SOD523  [SOD523]
D2  SBR1A20T5  DIODE_SOD523  [SOD523]
FID1  FIDUCIALUFIDUCIAL  [MICRO-FIDUCIAL]
FID2  FIDUCIALUFIDUCIAL  [MICRO-FIDUCIAL]
FID3  FIDUCIALUFIDUCIAL  [MICRO-FIDUCIAL]
FID4  FIDUCIALUFIDUCIAL  [MICRO-FIDUCIAL]
FID5  FIDUCIALUFIDUCIAL  [MICRO-FIDUCIAL]
FID6  FIDUCIALUFIDUCIAL  [MICRO-FIDUCIAL]
FID7  FIDUCIALUFIDUCIAL  [MICRO-FIDUCIAL]
FID8  FIDUCIALUFIDUCIAL  [MICRO-FIDUCIAL]
R65  33  RESISTOR0402-RES  [0402-RES]
R66  30k  RESISTOR0402-RES  [0402-RES]
R67  100k  RESISTOR0402-RES  [0402-RES]
R68  10k  RESISTOR0402-RES  [0402-RES]
R69  154k  RESISTOR0402-RES  [0402-RES]
R70  10k  RESISTOR0402-RES  [0402-RES]
TP17  TESTPOINT_ROUND  [TESTPAD_ROUND]
TP18  TESTPOINT_ROUND  [TESTPAD_ROUND]
TP19  TESTPOINT_ROUND  [TESTPAD_ROUND]
TP20  TESTPOINT1X01  [1X01]
TP21  TESTPOINTPADSMALL  [TESTPAD_SMALL]
TP22  TESTPOINT_ROUND  [TESTPAD_ROUND]
U11  MCP1755_DFN  [DFN8_2X3MM]
U12  MCP1755_DFN  [DFN8_2X3MM]
U13  ADP7142_WSON  [WSON6]
U14  ADP7182_WSON  [WSON6]
U15  ADP7182_WSON  [WSON6]

### Nets
GND: C88.2 C89.2 C90.2 C91.2 C92.2 C93.2 C94.2 C95.2 C96.2 C97.2 C98.2 C99.2 C100.2 C101.2 C102.2 C103.2 C104.2 C105.2 C106.1 C107.1 C108.1 C109.1 C111.2 C112.1 C113.2 R67.1 R68.2 TP20.1 U10.PAD(_PWR:GND) U11.4(GND) U11.P(GND) U12.4(GND) U12.P(GND) U13.3(GND) U13.PAD(GND) U14.5(GND) U15.5(GND) ; also sheet 1,2,3,4,5
N$27: R68.1 R69.2 R70.2 U15.2(NC/ADJ)
N$28: R66.1 R67.2 U13.2(SENSE/ADJ)
N$43: C93.1 R65.2 U10.43(_PWR:ADC_VDD)
N$108: C110.1 R70.1
OPT_EN_VN: U15.3(EN) ; also sheet 5
OPT_EN_VP: U13.4(EN) ; also sheet 5
V1P1: C91.1 C96.1 C97.1 TP21.P$1 U10.23(_PWR:DVDD) U10.45(_PWR:VREG_VOUT) U10.50(_PWR:DVDD)
V3P3: C90.1 C92.1 C98.1 C99.1 C100.1 C101.1 C102.1 C103.1 C113.1 R65.1 TP17.P$1 U10.1(_PWR:IOVDD) U10.10(_PWR:IOVDD) U10.22(_PWR:IOVDD) U10.33(_PWR:IOVDD) U10.42(_PWR:IOVDD) U10.44(_PWR:VREG_VIN) U10.48(_PWR:USB_VDD) U10.49(_PWR:IOVDD) U11.1(OUT) ; also sheet 1,2,3,4,5
V3P3A: C95.1 C111.1 TP18.P$1 U12.1(OUT) ; also sheet 1,2,3,4
V5P0: C88.1 C89.1 C94.1 D1.C D2.C TP22.P$1 U11.5(/SHDN) U11.8(IN) U12.5(/SHDN) U12.8(IN)
V5P0_IN: D1.A ; also sheet 5
V6P5: C105.1 R66.2 U13.1(VOUT) ; also sheet 1
V9P0: C104.1 U13.6(VIN) ; also sheet 5
VBUS: D2.A ; also sheet 5
VN1P2: C107.2 C112.2 TP19.P$1 U14.1(OUT) U14.2(NC/ADJ) ; also sheet 1,2,3,4
VN3P0: C106.2 U14.3(EN) U14.6(IN) U14.PAD(IN) ; also sheet 5
VN20P0: C109.2 C110.2 R69.1 U15.1(OUT) ; also sheet 1
VN22: C108.2 U15.6(IN) U15.PAD(IN) ; also sheet 5
Unconnected: U11.2(PWRGD) U12.2(PWRGD) U13.5(SS)

### Notes on the sheet
- Voltage Regulators
- use 5V fixed output version
  ADP7142ACPZN5.0-R7
- nominal: 1.22*(1+154/10) = 20.0V

## Library data of the parts
C1-C113 = MyLib:CAP: Capacitor Standard 0603 ceramic capacitor, and 0.1" leaded capacitor.
D1 D2 = MyLib:DIODE
FID1-FID8 = MyLib:FIDUCIAL: Fiducial Alignment Points Various fiducial points for machine vision alignment.
J1 = MyLib:M17X2: SAM9921-ND
J2 = MyLib:M05X2: Header M05X2 SMD_0.050: Sullind GRPB052VWQS-RC DigiKey S9012E-05-ND
J3 = MyLib:M03X1
J4 = MyLib:USB-MICRO: USB - micro B USB 2.0 Receptacle Connector solder retention 609-4618-2-ND
J5 = MyLib:M20X2
LED1 = MyLib:LED: LEDs Standard schematic elements and footprints for 5mm, 3mm, 1206, and 0603 sized LEDs. 5mm - Spark Fun Electronics SKU : COM-00529 (and others)
LF1 LF2 = MyLib:FERRITE: Ferrite e.g. 445-1561-1-ND
R1-R70 = MyLib:RESISTOR: Resistor Basic schematic elements and footprints for 0603, 1206, and PTH resistors.
S1 = MyLib:SWITCH-MOMENTARY-2: Various NO switches- pushbuttons, reed, etc
TP1-TP9 TP11-TP13 TP15-TP22 = MyLib:TESTPOINT
U1 U3 U5 U7 = MyLib:AD7380: ADC Dual Simultaneous Sampling 16-Bit/14-Bit 4 MSPS SAR Differential Inputs
U2 U4 U6 U8 = MyLib:ADA4940-2: ADC Driver Fully Differential, Ultralow Power, Low Distortion 260 MHz
U9 = MyLib:W25Q: Flash, Serial e.g. W25Q16JVUXIQ
U10 = MyLib:RP2040: RP2040 Raspberry Pi Pico Microcontroller
U11 U12 = MyLib:MCP1755: LDO 16V 300 mA e.g. MCP1755-3302E/MC-ND
U13 = MyLib:ADP7142: LDO 40V 200mA e.g. ‎505-ADP7142ACPZN-R7CT-ND‎
U14 U15 = MyLib:ADP7182: Negative LDO
X1 = MyLib:CRYSTAL-3.2-2.5: SMD Quartz Crystal e.g. CTS Series 403